# EAGLE design tarjeta (EAGLE 8.6.3)
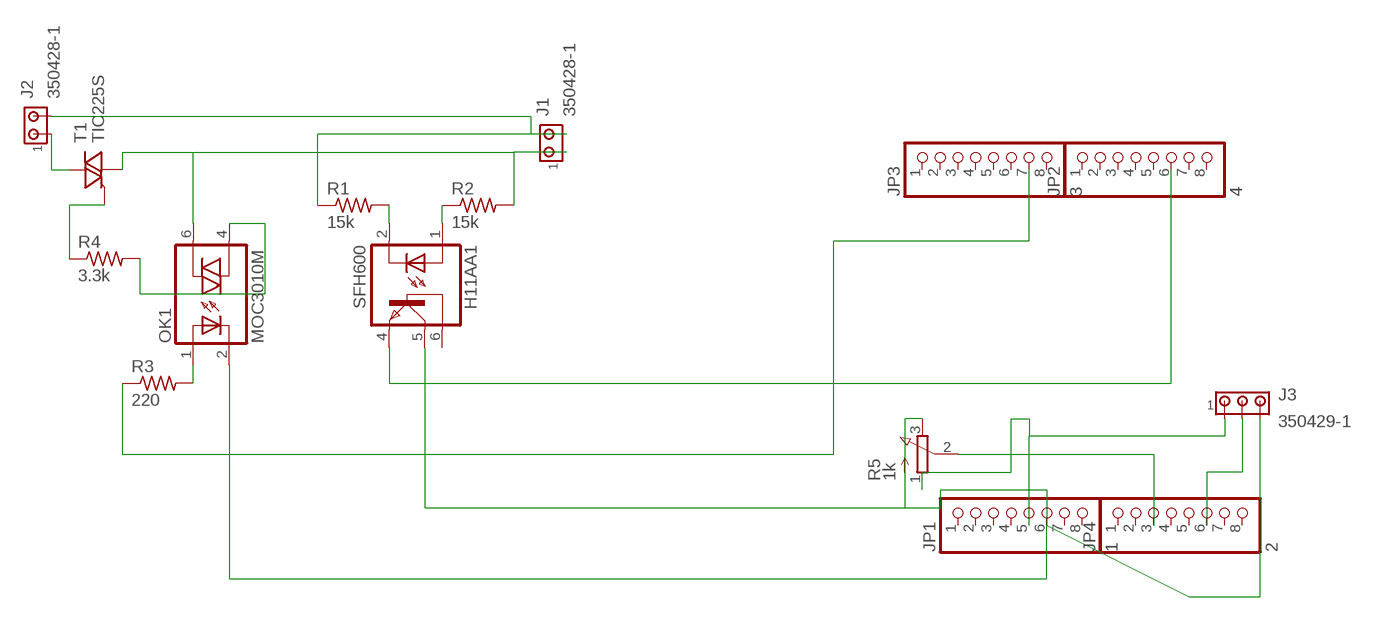
[diagram p0: schematic, sheet 1]

## Parts
H11AA1  SFH600  [DIL06]
J1  350428-1  [350428-1]
J2  350428-1  [350428-1]
J3  350429-1  [350429-1]
JP1  1  PINHD-1X8/90  [1X08/90]
JP2  4  PINHD-1X8/90  [1X08/90]
JP3  3  PINHD-1X8/90  [1X08/90]
JP4  2  PINHD-1X8/90  [1X08/90]
OK1  MOC3010M  [DIL06]
R1  15k  R-US_0207/10  [0207/10]
R2  15k  R-US_0207/10  [0207/10]
R3  220  R-US_0207/10  [0207/10]
R4  3.3k  R-US_0207/10  [0207/10]
R5  1k  3RP/1610N  [3RP/1610N]
T1  TIC225S  [TO220DS]

## Nets
5V: J3.1 JP1.5 R5.1(A)
110V: J1.1 OK1.6(A2) R2.2 T1.A1
GND: H11AA1.5(COL) J3.3 JP1.6 OK1.2(C) R5.3(E)
N$1: JP3.7 R3.1
N$3: OK1.4(A1) R4.2
N$5: J2.1 T1.A2
N$6: H11AA1.1(A) R2.1
N$8: H11AA1.2(C) R1.2
N$10: R4.1 T1.G
N$13: OK1.1(A) R3.2
N$14: H11AA1.4(EMI) JP2.6
NEUTRO: J1.2 J2.2 R1.1
POTENCIOMETRO: JP4.3 R5.2(S)
SENSOR: J3.2 JP4.6
Unconnected: H11AA1.6(BAS) JP1.1 JP1.2 JP1.3 JP1.4 JP1.7 JP1.8 JP2.1 JP2.2 JP2.3 JP2.4 JP2.5 JP2.7 JP2.8 JP3.1 JP3.2 JP3.3 JP3.4 JP3.5 JP3.6 JP3.8 JP4.1 JP4.2 JP4.4 JP4.5 JP4.7 JP4.8

## Library data of the parts
H11AA1 = optocoupler-2:SFH600: SIEMENS OPTO COUPLER
J1 J2 = con-amp:350428-1: Universal MATE-N-LOK .250" Centerline, 600 V, 19 - 36 A max Source: http://catalog.tycoelectronics.com/ .. ENG_CD_350428_Y.pdf
J3 = con-amp:350429-1: Universal MATE-N-LOK .250" Centerline, 600 V, 19 - 36 A max Source: http://catalog.tycoelectronics.com/ .. ENG_CD_350429_Y.pdf
JP1-JP4 = pinhead:PINHD-1X8: PIN HEADER
OK1 = optocoupler-2:MOC30*M: RANDOM-PHASE OPTOISOLATORS TRIAC DRIVER OUTPUT Source: http://www.fairchildsemi.com MOC3020-M.pdf
R1-R4 = rcl:R-US_: RESISTOR, American symbol; SPICEPREFIX: R
R5 = pot:3RP/1610N: 16mm Potentiometer one level Source: http://www.alphapotentiometers.net/html/16mm_pot_2.html
T1 = triac:TIC225S: TRIAC

## Board
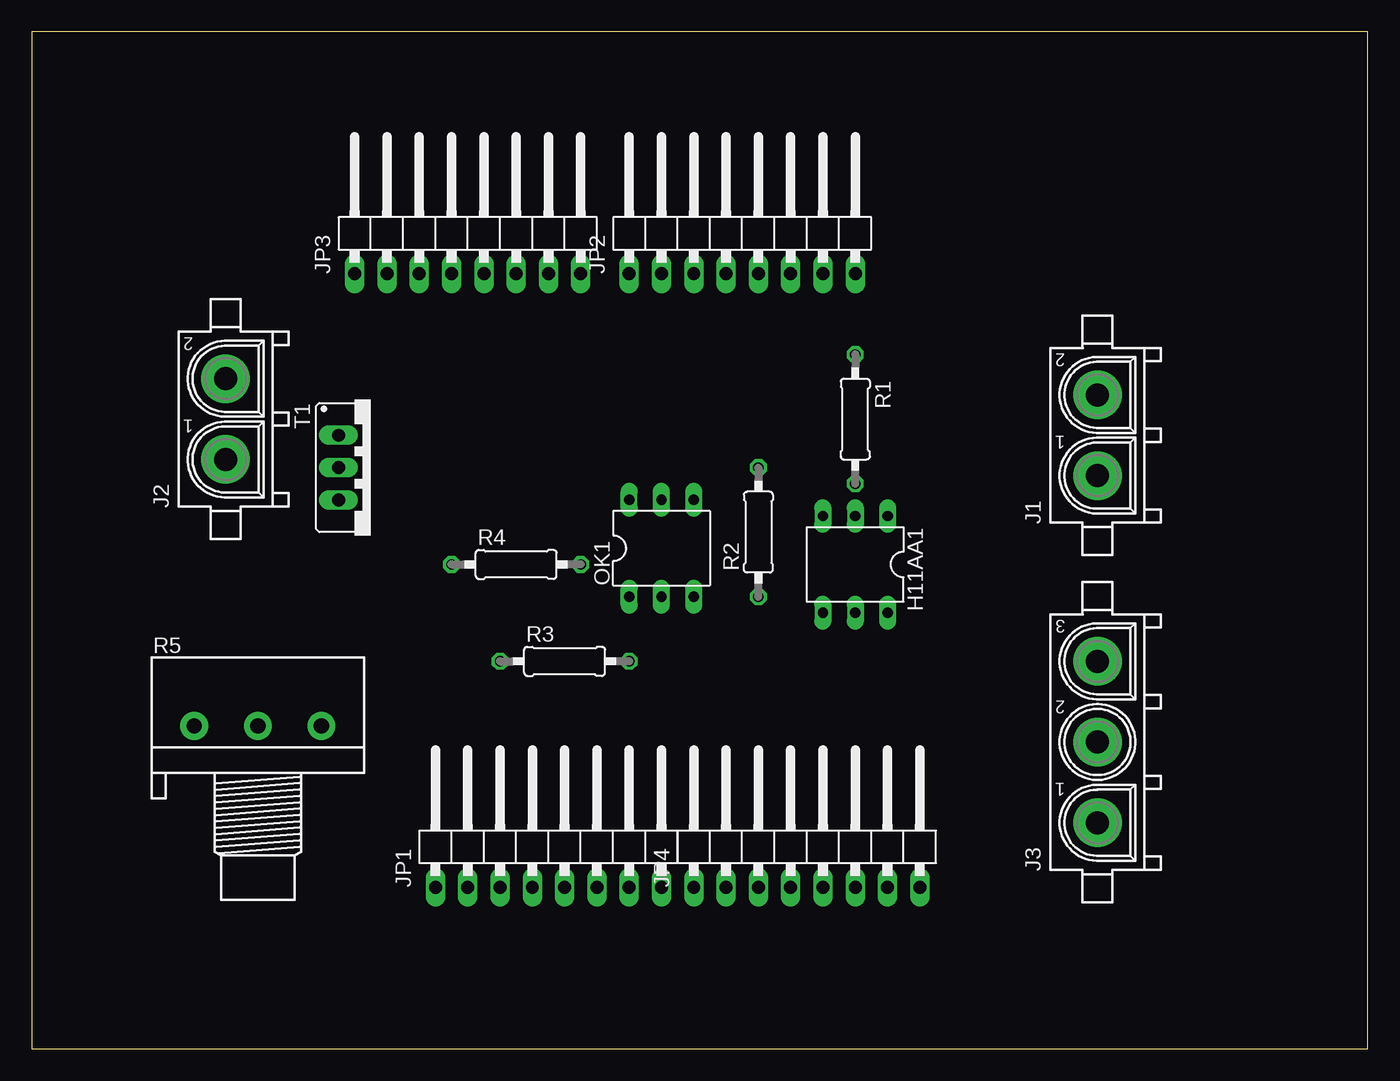
[diagram p1: board, top side]
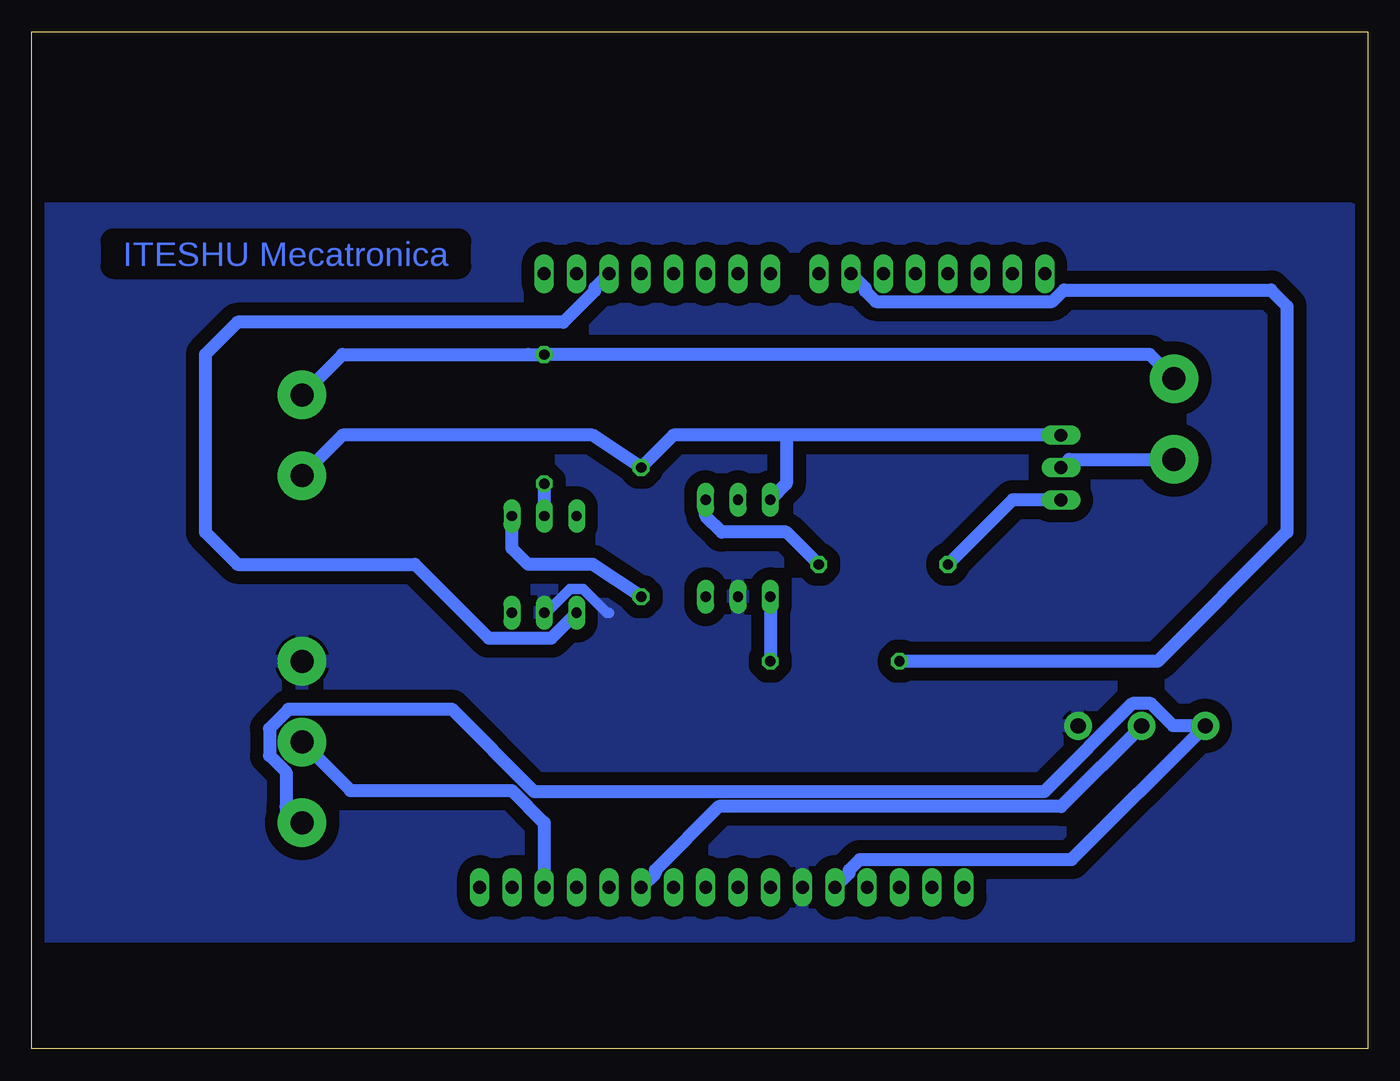
[diagram p2: board, bottom side, seen from below]

Size 105.08 x 80 mm. Coordinates in mm from the lower left corner, seen from the top.
Outline: 0,0 105.08,0 105.08,80 0,80 0,0
Copper layers (1*16): Top 0.035mm / dielectric 1.5mm / Bottom 0.035mm
Design rules "default": minimum track width 6mil, minimum drill 0.35mm, track to track 6mil, track to pad 6mil, pad to pad 6mil, via to via 6mil, smd to smd 6mil, copper to edge 40mil, drill to drill 6mil, minimum pad ring 10mil, minimum via ring 8mil, stop-mask expansion 4mil, vias tented up to drill 0mil, thermal gap 10mil

### Footprints (pad centres in the part's own frame; a part is rotated, then mirrored left to right if it is on the bottom)
DIL06 = drill 0.813 long: 1 -2.54,-3.81; 2 0,-3.81; 3 2.54,-3.81; 4 2.54,3.81; 5 0,3.81; 6 -2.54,3.81
350428-1 = drill 1.8 pad 3.81: 1 -3.175,0; 2 3.175,0
350429-1 = drill 1.8 pad 3.81: 1 -6.35,0; 2 0,0; 3 6.35,0
1X08/90 = drill 1.016 long: 1 -8.89,-3.81; 2 -6.35,-3.81; 3 -3.81,-3.81; 4 -1.27,-3.81; 5 1.27,-3.81; 6 3.81,-3.81; 7 6.35,-3.81; 8 8.89,-3.81
0207/10 = drill 0.813 octagon: 1 -5.08,0; 2 5.08,0
3RP/1610N = drill 1.2 pad 2.184: 1 -5,0; 2 0,0; 3 5,0
TO220DS = drill 1.016 long: A1 -2.54,-2.54; A2 0,-2.54; G 2.54,-2.54

### Placement (x,y rotation side)
H11AA1  64.77,38.1 180 top
J1  83.82,48.26 90 top
J2  15.24,49.53 90 top
J3  83.82,24.13 90 top
JP1  40.64,16.51 0 top
JP2  55.88,64.77 0 top
JP3  34.29,64.77 0 top
JP4  60.96,16.51 0 top
OK1  49.53,39.37 0 top
R1  64.77,49.53 270 top
R2  57.15,40.64 90 top
R3  41.91,30.48 0 top
R4  38.1,38.1 0 top
R5  17.78,25.4 0 top
T1  26.67,45.72 270 top

### Tracks (layer width: path | path; a pad name or v marks a point on that pad's centre or on a via)
5V
  Bottom 1.016: JP1.5 40.79,13.82 40.79,14.05 39.96,14.88 23.3,14.88 R5.1 15.3,25.4 17.05,27.15 18.51,27.15 25.44,20.22 65.56,20.22 72.03,26.7 84.88,26.7 86.39,25.19 86.39,23.07 85.09,21.77 85.09,19.05 | 85.09,19.05 85.09,17.78 | J3.1 85.09,19.05
110V
  Bottom 1.016: T1.A1 45.72,48.26 | 45.72,48.26 45.72,44.45 OK1.6 | 45.72,48.26 54.61,48.26 R2.2 60.96,48.26 80.64,48.26 J1.1
GND
  Bottom 0.813: 59.69,34.29 59.84,34.29 61.73,36.17 62.73,36.17 64.61,34.29 H11AA1.5
  pour Bottom (isolate 1.016): 104.14,63.5 104.14,8.89 1.27,8.89 1.27,66.04 104.14,66.04
N$1
  Bottom 1.016: JP3.7 39.52,59.84 39.52,59.61 38.69,58.78 24.81,58.78 23.9,59.69 7.62,59.69 6.35,58.42 6.35,40.64 16.51,30.48 R3.1
N$3
  Bottom 1.016: R4.2 45.72,40.64 50.8,40.64 52.07,41.91 OK1.4
N$5
  Bottom 1.016: T1.A2 23.49,46.35 J2.1
N$6
  Bottom 1.016: R2.1 60.96,38.1 66.04,38.1 67.31,39.37 H11AA1.1
N$8
  Bottom 1.016: R1.2 H11AA1.2
N$10
  Bottom 1.016: T1.G 27.94,43.18 R4.1
N$13
  Bottom 1.016: OK1.1 R3.2
N$14
  Bottom 1.016: JP2.6 60.81,59.84 60.81,59.61 63.27,57.15 88.9,57.15 91.44,54.61 91.44,40.64 88.9,38.1 74.93,38.1 69.14,32.31 64.21,32.31 H11AA1.4
NEUTRO
  Bottom 1.016: J1.2 80.64,54.61 66.04,54.61 R1.1 17.14,54.61 J2.2
POTENCIOMETRO
  Bottom 1.016: R5.2 24.13,19.05 51.03,19.05 56.03,14.05 56.03,13.82 JP4.3
SENSOR
  Bottom 1.016: J3.2 80.01,20.32 67.31,20.32 64.77,17.78 JP4.6

### Text on the board
Bottom: ITESHU Mecatronica